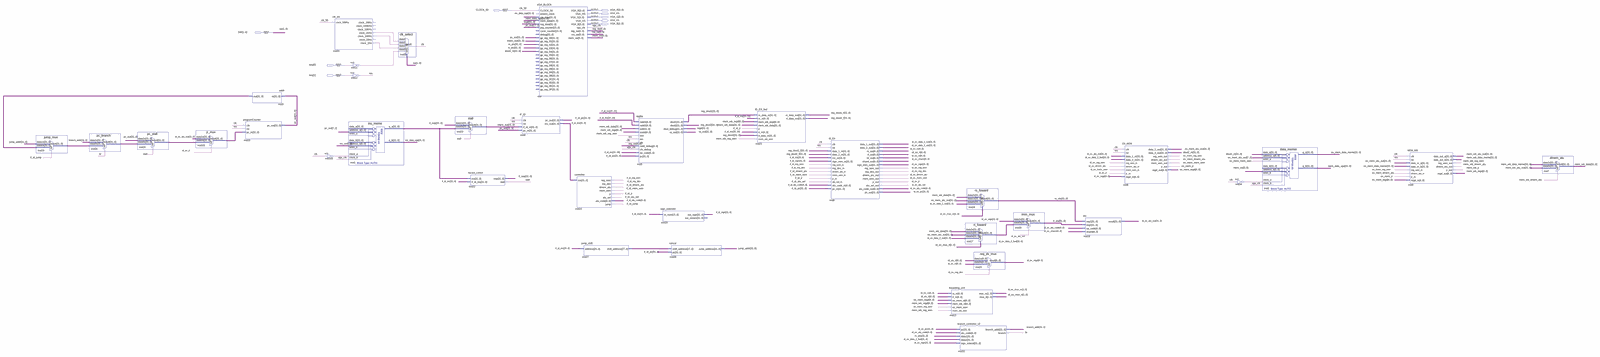
[diagram p0: schematic sheet, whole]
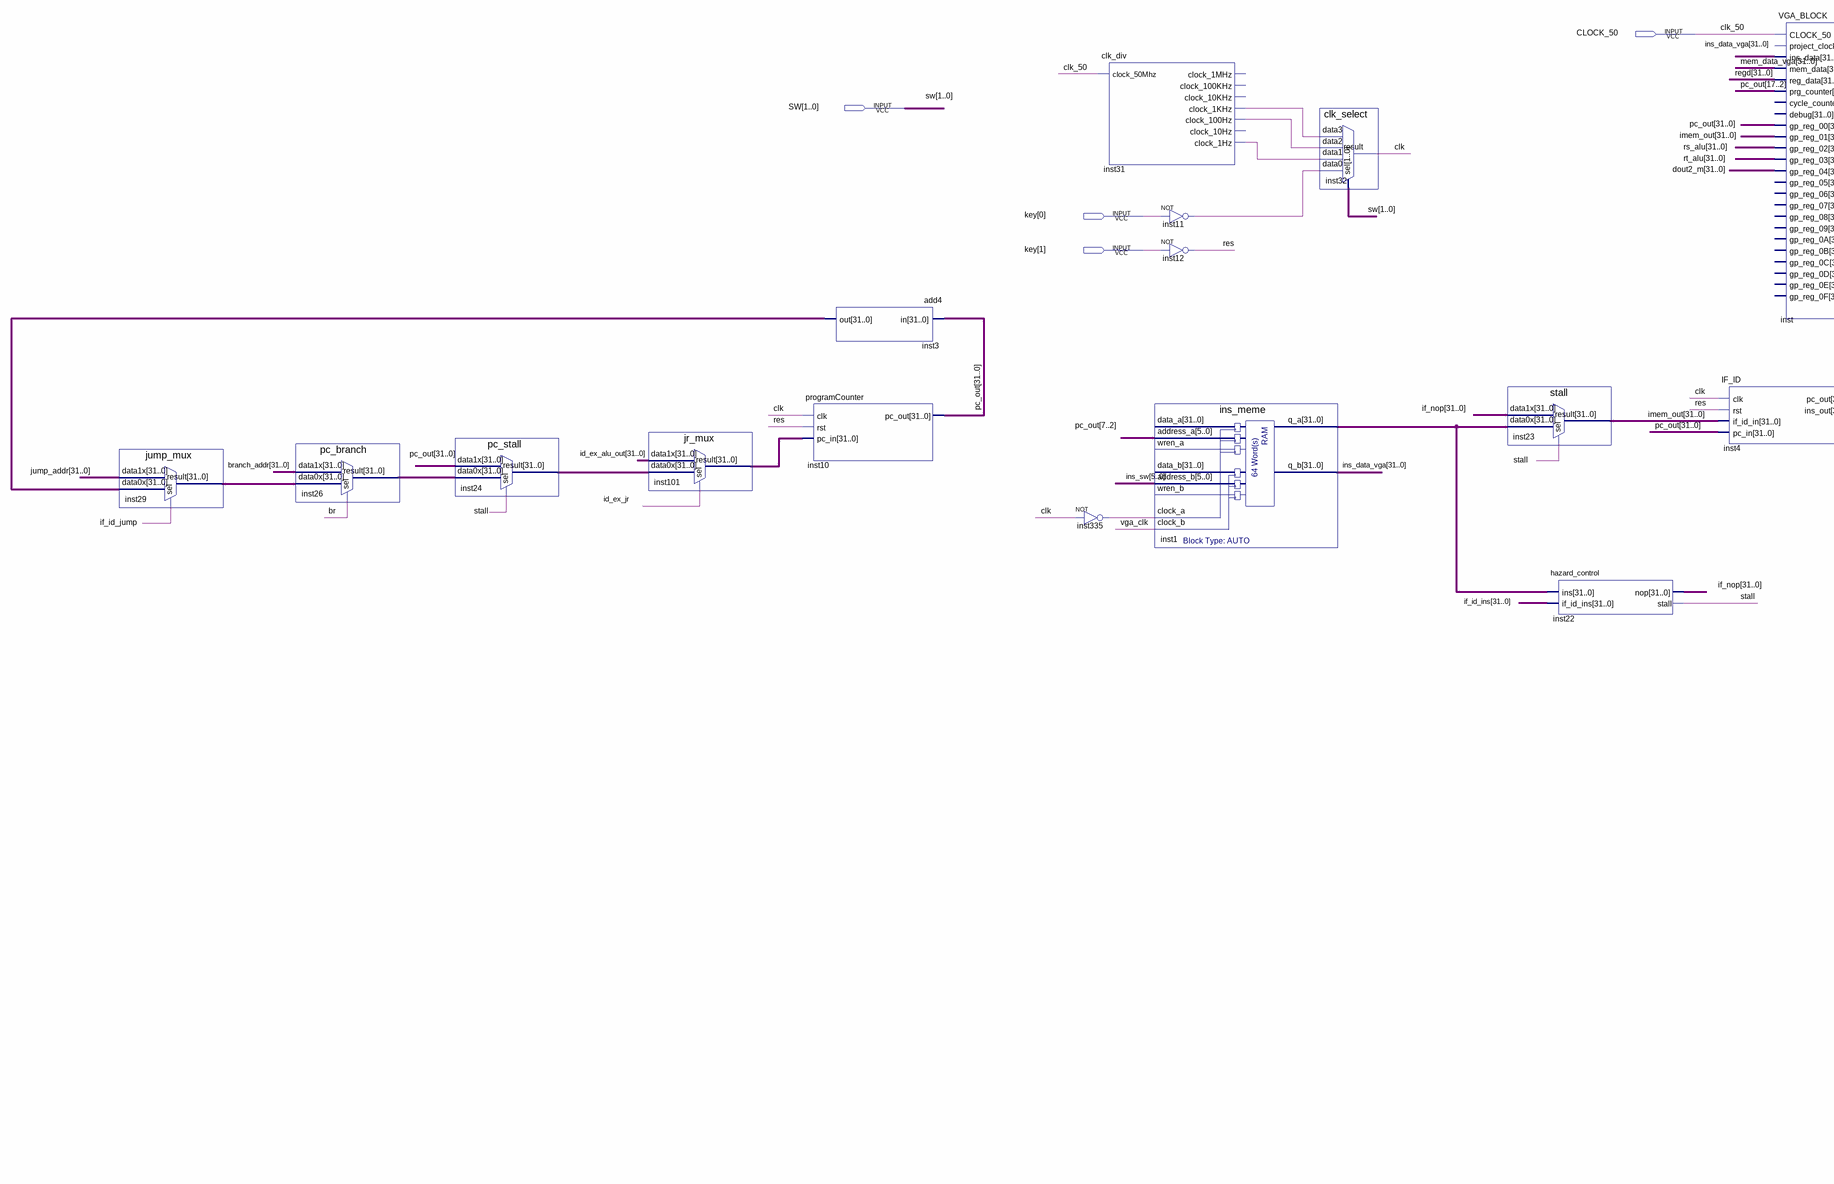
[diagram p1: schematic sheet, left part]
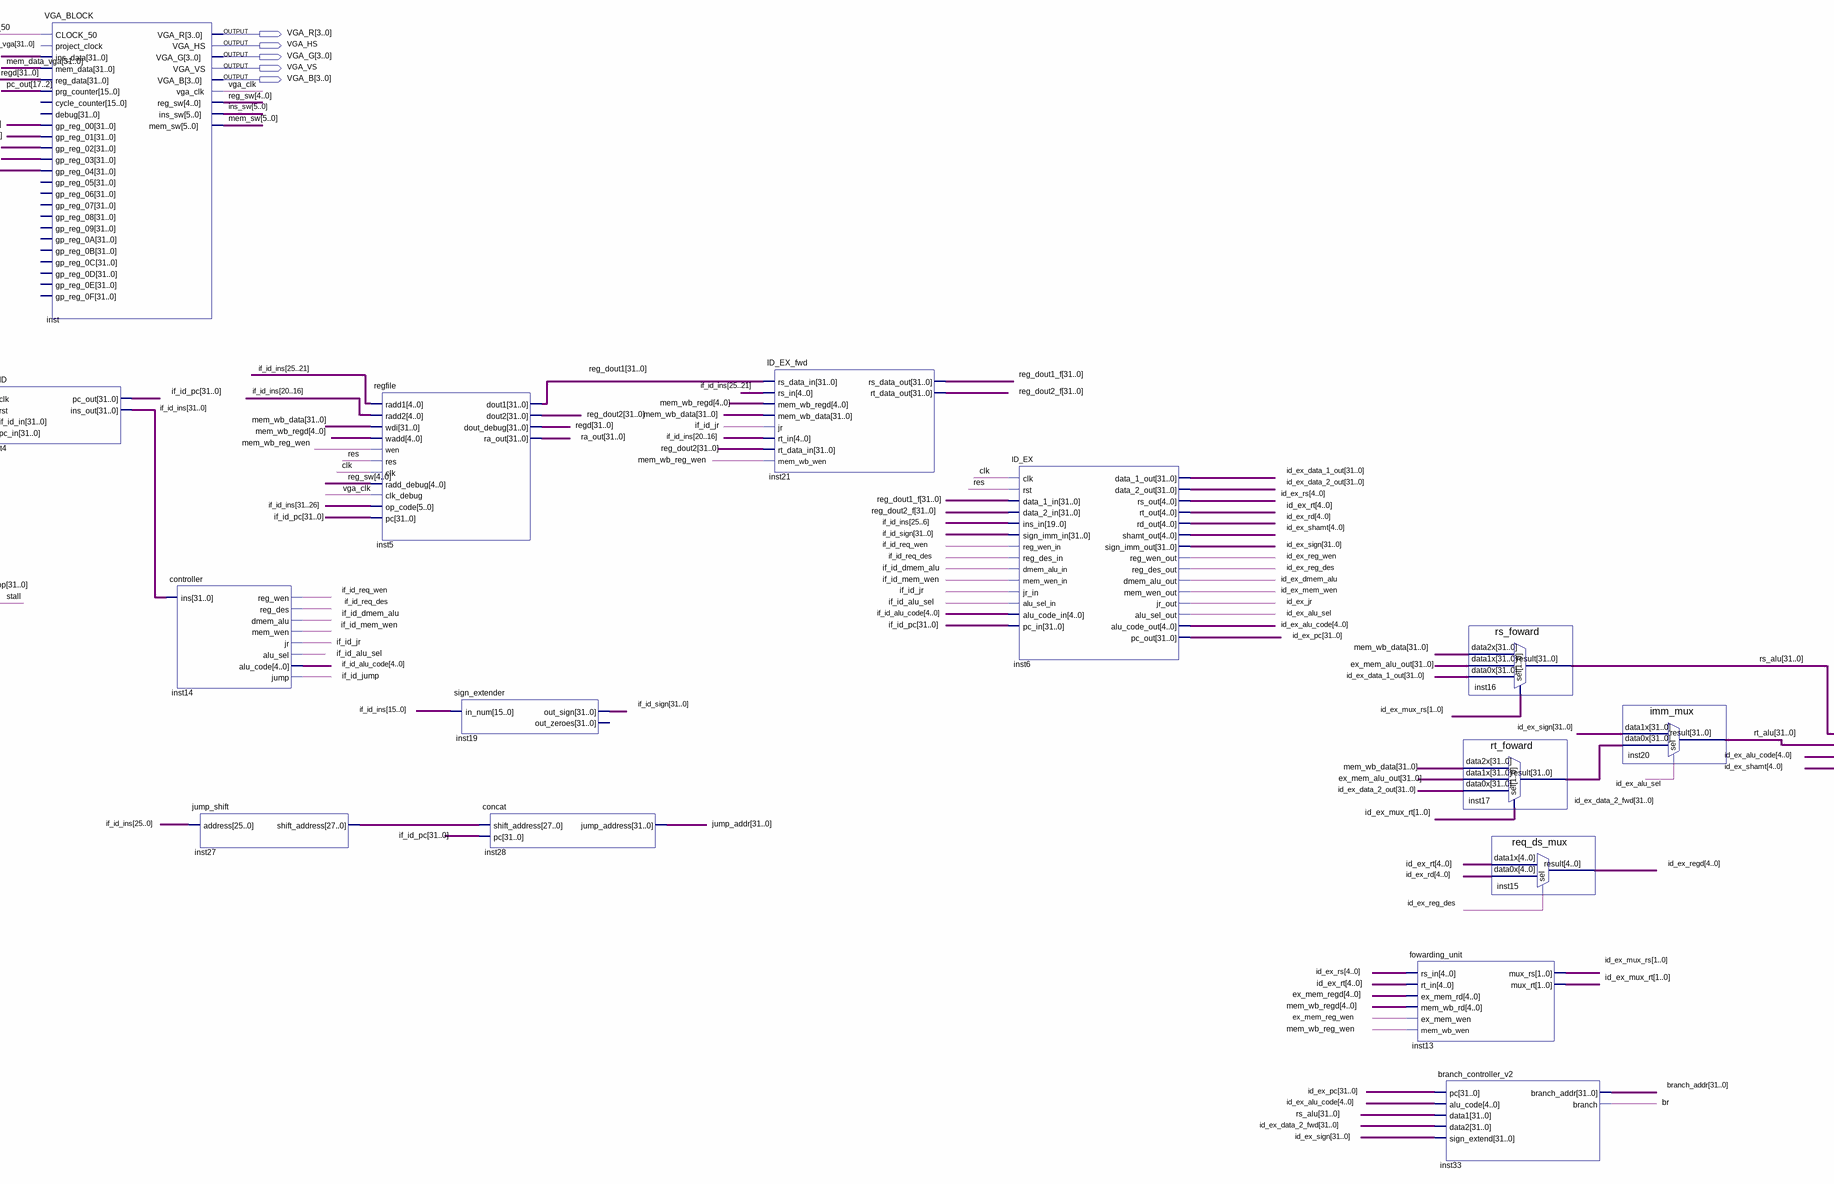
[diagram p2: schematic sheet, centre part]
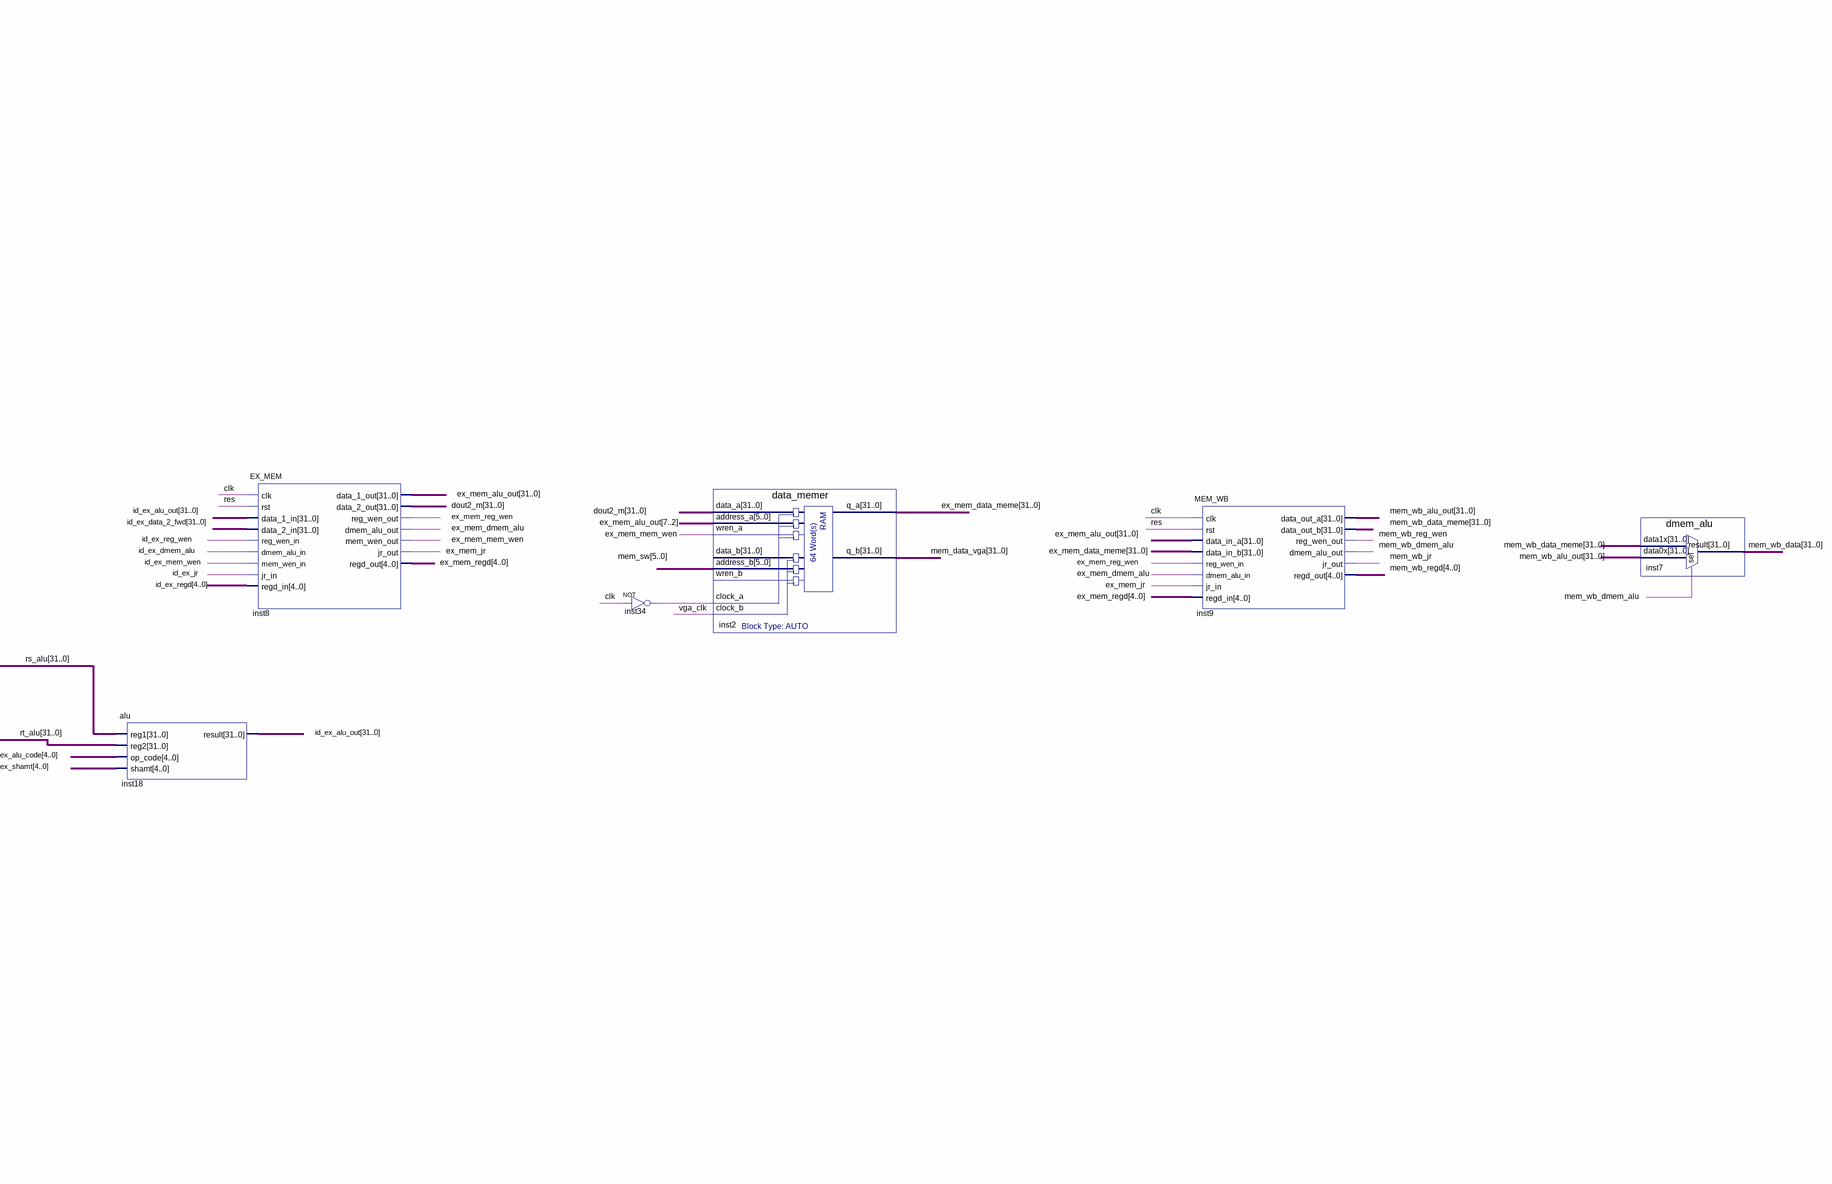
[diagram p3: schematic sheet, right part]
// Quartus schematic pipeline_project.bdf as structural Verilog: 35 symbols, 9 pins
module pipeline_project (
  input  CLOCK_50,
  input  [1:0] SW,
  input  [1:0] key,
  output [3:0] VGA_R,
  output VGA_HS,
  output [3:0] VGA_G,
  output VGA_VS,
  output [3:0] VGA_B
);

  wire br, clk, ex_mem_dmem_alu, ex_mem_jr, ex_mem_mem_wen, ex_mem_reg_wen, id_ex_alu_sel, id_ex_dmem_alu,
       id_ex_jr, id_ex_mem_wen, id_ex_reg_des, id_ex_reg_wen, if_id_alu_sel, if_id_dmem_alu, if_id_jr,
       if_id_jump, if_id_mem_wen, if_id_req_des, if_id_req_wen, inst11_out, inst31_clock_1hz,
       inst31_clock_1khz, inst31_clock_100hz, inst34_out, inst335_out, mem_wb_dmem_alu, mem_wb_jr,
       mem_wb_reg_wen, res, stall, vga_clk;
  wire [1:0] id_ex_mux_rs, id_ex_mux_rt;
  wire [4:0] ex_mem_regd, id_ex_alu_code, id_ex_rd, id_ex_regd, id_ex_rs, id_ex_rt, id_ex_shamt,
       if_id_alu_code, mem_wb_regd, reg_sw;
  wire [5:0] ins_sw, mem_sw;
  wire [27:0] inst27_shift_address;
  wire [31:0] branch_addr, dout2_m, ex_mem_alu_out, ex_mem_data_meme, id_ex_alu_out, id_ex_data_1_out,
       id_ex_data_2_fwd, id_ex_data_2_out, id_ex_pc, id_ex_sign, if_id_ins, if_id_pc, if_id_sign, if_nop,
       imem_out, ins_data_vga, inst1_q_a, inst3_out, inst24_result, inst26_result, inst29_result,
       inst101_result, jump_addr, mem_data_vga, mem_wb_alu_out, mem_wb_data, mem_wb_data_meme, pc_out,
       ra_out, reg_dout1, reg_dout1_f, reg_dout2, reg_dout2_f, regd, rs_alu, rt_alu;

  jump_mux inst29 (.data1x(jump_addr), .data0x(inst3_out), .sel(if_id_jump), .result(inst29_result));
  pc_branch inst26 (.data1x(branch_addr), .data0x(inst29_result), .sel(br), .result(inst26_result));
  pc_stall inst24 (.data1x(pc_out), .data0x(inst26_result), .sel(stall), .result(inst24_result));
  jr_mux inst101 (.data1x(id_ex_alu_out), .data0x(inst24_result), .sel(id_ex_jr), .result(inst101_result));
  add4 inst3 (.in(pc_out), .out(inst3_out));
  programCounter inst10 (.clk(clk), .rst(res), .pc_in(inst101_result), .pc_out(pc_out));
  clk_div inst31 (
    .clock_50Mhz(CLOCK_50), .clock_1KHz(inst31_clock_1khz), .clock_100Hz(inst31_clock_100hz),
    .clock_1Hz(inst31_clock_1hz));  // open: clock_1MHz, clock_100KHz, clock_10KHz, clock_10Hz
  not inst335 (inst335_out, clk);
  not inst11 (inst11_out, key[0]);
  not inst12 (res, key[1]);
  ins_meme inst1 (
    .address_a(pc_out[7:2]), .address_b(ins_sw), .clock_a(inst335_out), .clock_b(vga_clk), .q_a(inst1_q_a),
    .q_b(ins_data_vga));  // open: data_a, wren_a, data_b, wren_b
  clk_select inst32 (
    .data3(inst31_clock_1khz), .data2(inst31_clock_100hz), .data1(inst31_clock_1hz), .data0(inst11_out),
    .sel(SW), .result(clk));
  stall inst23 (.data1x(if_nop), .data0x(inst1_q_a), .sel(stall), .result(imem_out));
  hazard_control inst22 (.ins(inst1_q_a), .if_id_ins(if_id_ins), .nop(if_nop), .stall(stall));
  IF_ID inst4 (.clk(clk), .rst(res), .if_id_in(imem_out), .pc_in(pc_out), .pc_out(if_id_pc), .ins_out(if_id_ins));
  VGA_BLOCK inst (
    .CLOCK_50(CLOCK_50), .ins_data(ins_data_vga), .mem_data(mem_data_vga), .reg_data(regd),
    .prg_counter(pc_out[17:2]), .gp_reg_00(pc_out), .gp_reg_01(imem_out), .gp_reg_02(rs_alu),
    .gp_reg_03(rt_alu), .gp_reg_04(dout2_m), .VGA_R(VGA_R), .VGA_HS(VGA_HS), .VGA_G(VGA_G), .VGA_VS(VGA_VS),
    .VGA_B(VGA_B), .vga_clk(vga_clk), .reg_sw(reg_sw), .ins_sw(ins_sw), .mem_sw(mem_sw));  // open: project_clock, cycle_counter, debug, gp_reg_05, gp_reg_06, gp_reg_07, gp_reg_08, gp_reg_09, gp_reg_0A, gp_reg_0B, gp_reg_0C, gp_reg_0D, gp_reg_0E, gp_reg_0F
  controller inst14 (
    .ins(if_id_ins), .reg_wen(if_id_req_wen), .reg_des(if_id_req_des), .dmem_alu(if_id_dmem_alu),
    .mem_wen(if_id_mem_wen), .jr(if_id_jr), .alu_sel(if_id_alu_sel), .alu_code(if_id_alu_code),
    .jump(if_id_jump));
  jump_shift inst27 (.address(if_id_ins[25:0]), .shift_address(inst27_shift_address));
  regfile inst5 (
    .radd1(if_id_ins[25:21]), .radd2(if_id_ins[20:16]), .wdi(mem_wb_data), .wadd(mem_wb_regd),
    .wen(mem_wb_reg_wen), .res(res), .clk(clk), .radd_debug(reg_sw), .clk_debug(vga_clk),
    .op_code(if_id_ins[31:26]), .pc(if_id_pc), .dout1(reg_dout1), .dout2(reg_dout2), .dout_debug(regd),
    .ra_out(ra_out));
  sign_extender inst19 (.in_num(if_id_ins[15:0]), .out_sign(if_id_sign));  // open: out_zeroes
  concat inst28 (.shift_address(inst27_shift_address), .pc(if_id_pc), .jump_address(jump_addr));
  ID_EX_fwd inst21 (
    .rs_data_in(reg_dout1), .rs_in(if_id_ins[25:21]), .mem_wb_regd(mem_wb_regd), .mem_wb_data(mem_wb_data),
    .jr(if_id_jr), .rt_in(if_id_ins[20:16]), .rt_data_in(reg_dout2), .mem_wb_wen(mem_wb_reg_wen),
    .rs_data_out(reg_dout1_f), .rt_data_out(reg_dout2_f));
  ID_EX inst6 (
    .clk(clk), .rst(res), .data_1_in(reg_dout1_f), .data_2_in(reg_dout2_f), .ins_in(if_id_ins[25:6]),
    .sign_imm_in(if_id_sign), .reg_wen_in(if_id_req_wen), .reg_des_in(if_id_req_des),
    .dmem_alu_in(if_id_dmem_alu), .mem_wen_in(if_id_mem_wen), .jr_in(if_id_jr), .alu_sel_in(if_id_alu_sel),
    .alu_code_in(if_id_alu_code), .pc_in(if_id_pc), .data_1_out(id_ex_data_1_out),
    .data_2_out(id_ex_data_2_out), .rs_out(id_ex_rs), .rt_out(id_ex_rt), .rd_out(id_ex_rd),
    .shamt_out(id_ex_shamt), .sign_imm_out(id_ex_sign), .reg_wen_out(id_ex_reg_wen),
    .reg_des_out(id_ex_reg_des), .dmem_alu_out(id_ex_dmem_alu), .mem_wen_out(id_ex_mem_wen),
    .jr_out(id_ex_jr), .alu_sel_out(id_ex_alu_sel), .alu_code_out(id_ex_alu_code), .pc_out(id_ex_pc));
  fowarding_unit inst13 (
    .rs_in(id_ex_rs), .rt_in(id_ex_rt), .ex_mem_rd(ex_mem_regd), .mem_wb_rd(mem_wb_regd),
    .ex_mem_wen(ex_mem_reg_wen), .mem_wb_wen(mem_wb_reg_wen), .mux_rs(id_ex_mux_rs), .mux_rt(id_ex_mux_rt));
  rs_foward inst16 (
    .data2x(mem_wb_data), .data1x(ex_mem_alu_out), .data0x(id_ex_data_1_out), .sel(id_ex_mux_rs),
    .result(rs_alu));
  rt_foward inst17 (
    .data2x(mem_wb_data), .data1x(ex_mem_alu_out), .data0x(id_ex_data_2_out), .sel(id_ex_mux_rt),
    .result(id_ex_data_2_fwd));
  branch_controller_v2 inst33 (
    .pc(id_ex_pc), .alu_code(id_ex_alu_code), .data1(rs_alu), .data2(id_ex_data_2_fwd),
    .sign_extend(id_ex_sign), .branch_addr(branch_addr), .branch(br));
  req_ds_mux inst15 (.data1x(id_ex_rt), .data0x(id_ex_rd), .sel(id_ex_reg_des), .result(id_ex_regd));
  imm_mux inst20 (.data1x(id_ex_sign), .data0x(id_ex_data_2_fwd), .sel(id_ex_alu_sel), .result(rt_alu));
  alu inst18 (.reg1(rs_alu), .reg2(rt_alu), .op_code(id_ex_alu_code), .shamt(id_ex_shamt), .result(id_ex_alu_out));
  EX_MEM inst8 (
    .clk(clk), .rst(res), .data_1_in(id_ex_alu_out), .data_2_in(id_ex_data_2_fwd),
    .reg_wen_in(id_ex_reg_wen), .dmem_alu_in(id_ex_dmem_alu), .mem_wen_in(id_ex_mem_wen), .jr_in(id_ex_jr),
    .regd_in(id_ex_regd), .data_1_out(ex_mem_alu_out), .data_2_out(dout2_m), .reg_wen_out(ex_mem_reg_wen),
    .dmem_alu_out(ex_mem_dmem_alu), .mem_wen_out(ex_mem_mem_wen), .jr_out(ex_mem_jr), .regd_out(ex_mem_regd));
  not inst34 (inst34_out, clk);
  data_memer inst2 (
    .data_a(dout2_m), .address_a(ex_mem_alu_out[7:2]), .wren_a(ex_mem_mem_wen), .address_b(mem_sw),
    .clock_a(inst34_out), .clock_b(vga_clk), .q_a(ex_mem_data_meme), .q_b(mem_data_vga));  // open: data_b, wren_b
  MEM_WB inst9 (
    .clk(clk), .rst(res), .data_in_a(ex_mem_alu_out), .data_in_b(ex_mem_data_meme),
    .reg_wen_in(ex_mem_reg_wen), .dmem_alu_in(ex_mem_dmem_alu), .jr_in(ex_mem_jr), .regd_in(ex_mem_regd),
    .data_out_a(mem_wb_alu_out), .data_out_b(mem_wb_data_meme), .reg_wen_out(mem_wb_reg_wen),
    .dmem_alu_out(mem_wb_dmem_alu), .jr_out(mem_wb_jr), .regd_out(mem_wb_regd));
  dmem_alu inst7 (.data1x(mem_wb_data_meme), .data0x(mem_wb_alu_out), .sel(mem_wb_dmem_alu), .result(mem_wb_data));

  // Other names for the same wires on the sheet: clk_50 = CLOCK_50
endmodule
